# Altium schematic sheet Sheet_2_nizovie.SchDoc
size A4
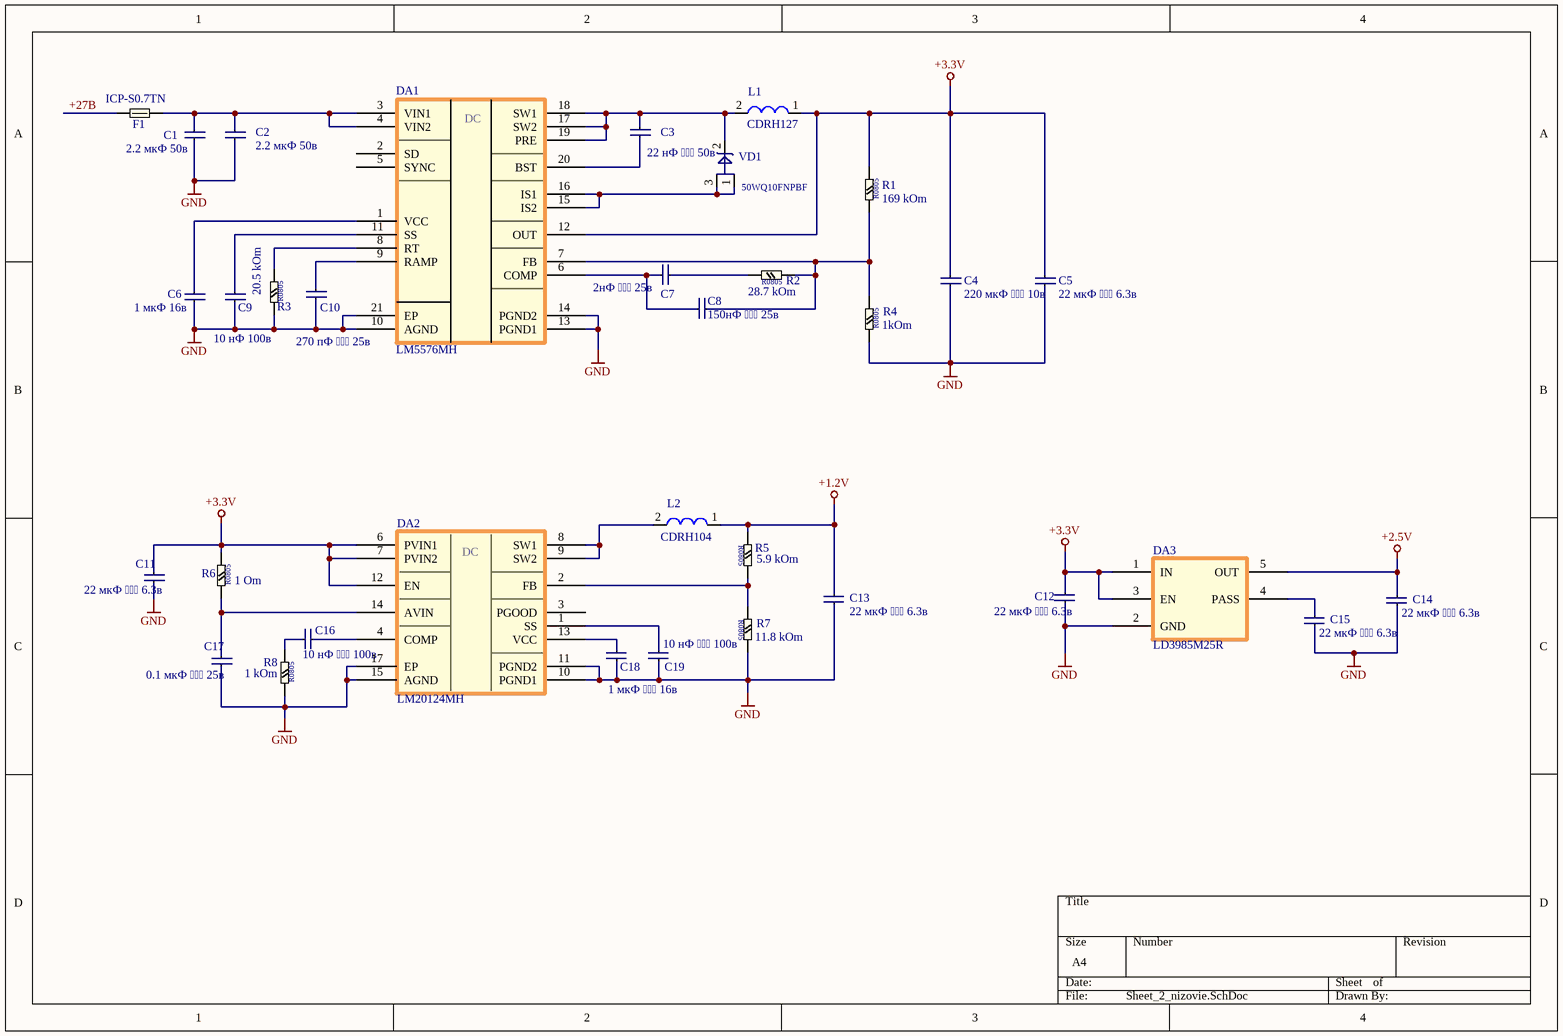
[diagram p0: Sheet_2_nizovie.SchDoc]

## Parts
C1  2.2 мкФ 50в  [FP_0805]
C2  2.2 мкФ 50в  [FP_0805]
C3  22 нФ  50в  [FP_0805]
C4  220 мкФ  10в  [TYPE_D]
C5  22 мкФ  6.3в  [FP_0805]
C6  1 мкФ 16в  [FP_0805]
C7  2нФ  25в  [FP_0805]
C8  150нФ  25в  [FP_0805]
C9  10 нФ 100в  [FP_0805]
C10  270 пФ  25в  [FP_0805]
C11  22 мкФ  6.3в  [FP_0805]
C12  22 мкФ  6.3в  [FP_0805]
C13  22 мкФ  6.3в  [FP_0805]
C14  22 мкФ  6.3в  [FP_0805]
C15  22 мкФ  6.3в  [FP_0805]
C16  10 нФ  100в  [FP_0805]
C17  0.1 мкФ  25в  [FP_0805]
C18  1 мкФ  16в  [FP_0805]
C19  10 нФ  100в  [FP_0805]
DA1  LM5576MH  [LM5576]
DA2  LM20124MH  [LM20124]
DA3  LD3985M25R  [LD3985]
F1  ICP-S0.7TN  [ICP-S0.7]
L1  CDRH127  [CDRH127]
L2  CDRH104  [CDRH104R]
R1  169 kOm  [FP_0805]
R2  28.7 kOm  [FP_0805]
R3  20.5 kOm  [FP_0805]
R4  1kOm  [FP_0805]
R5  5.9 kOm  [FP_0805]
R6  1 Om  [FP_0805]
R7  11.8 kOm  [FP_0805]
R8  1 kOm  [FP_0805]
VD1  50WQ10FNPBF  [50WQ06]

## Nets
+1.2V: C13.1 L2.1 R5.1
+2.5V: C14.1 DA3.5(OUT)
+3.3V: C4.2 C5.2 C11.2 C12.1 DA1.12(OUT) DA2.6(PVIN1) DA2.7(PVIN2) DA2.12(EN) DA3.1(IN) DA3.3(EN) L1.1 R1.2 R6.2
GND: C1.1 C2.1 C4.1 C5.1 C6.1 C9.1 C10.1 C11.1 C12.2 C13.2 C14.2 C15.2 C17.1 C18.2 C19.2 DA1.10(AGND) DA1.13(PGND1) DA1.14(PGND2) DA1.21(EP) DA2.10(PGND1) DA2.11(PGND2) DA2.15(AGND) DA2.17(EP) DA3.2(GND) R3.1 R4.1 R7.2 R8.1
+27В: F1.1
NetC1_2: C1.2 C2.2 DA1.3(VIN1) DA1.4(VIN2) F1.2
NetC3_1: C3.1 DA1.20(BST)
NetC3_2: C3.2 DA1.17(SW2) DA1.18(SW1) DA1.19(PRE) L1.2 VD1.2
NetC6_2: C6.2 DA1.1(VCC)
NetC7_1: C7.1 R2.1
NetC7_2: C7.2 C8.2 DA1.6(COMP)
NetC8_1: C8.1 DA1.7(FB) R1.1 R2.2 R4.2
NetC9_2: C9.2 DA1.11(SS)
NetC10_2: C10.2 DA1.9(RAMP)
NetC15_1: C15.1 DA3.4(PASS)
NetC16_1: C16.1 DA2.4(COMP)
NetC16_2: C16.2 R8.2
NetC17_2: C17.2 DA2.14(AVIN) R6.1
NetC18_1: C18.1 DA2.13(VCC)
NetC19_1: C19.1 DA2.1(SS)
NetDA1_8: DA1.8(RT) R3.2
NetDA1_15: DA1.15(IS2) DA1.16(IS1) VD1.1 VD1.3
NetDA2_2: DA2.2(FB) R5.2 R7.1
NetDA2_8: DA2.8(SW1) DA2.9(SW2) L2.2

Not connected (* = marked no-connect by the designer): DA1 2(SD) 5(SYNC); DA2 3(PGOOD)

## Notes on the sheet
- (in symbol LM5576MH) DC
- (in symbol LM20124MH) DC

## Library data of the parts
C1-C19 = C0805
R1-R3 R5-R8 = R0805: 1kOm
R4 = R0805